# Altium schematic sheet OutputMultiplexer.SchDoc
size A4
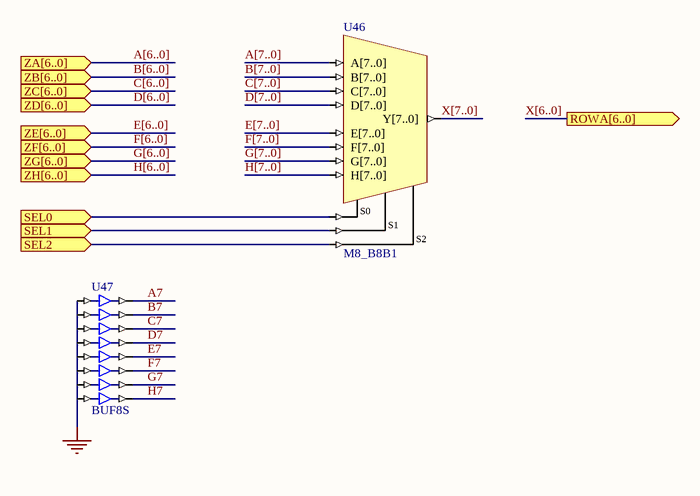
[diagram p0: OutputMultiplexer.SchDoc]

## Parts
U46  M8_B8B1
U47  BUF8S

## Ports
ROWA[6..0] (out), SEL0 (in), SEL1 (in), SEL2 (in), ZA[6..0] (in), ZB[6..0] (in), ZC[6..0] (in), ZD[6..0] (in), ZE[6..0] (in), ZF[6..0] (in), ZG[6..0] (in), ZH[6..0] (in)

## Nets
GND: U47.I0 U47.I1 U47.I2 U47.I3 U47.I4 U47.I5 U47.I6 U47.I7
A7: U47.O0
A[7..0]: U46.A[7..0]
B7: U47.O1
B[7..0]: U46.B[7..0]
C7: U47.O2
C[7..0]: U46.C[7..0]
D7: U47.O3
D[7..0]: U46.D[7..0]
E7: U47.O4
E[7..0]: U46.E[7..0]
F7: U47.O5
F[7..0]: U46.F[7..0]
G7: U47.O6
G[7..0]: U46.G[7..0]
H7: U47.O7
H[7..0]: U46.H[7..0]
SEL0: U46.S0 ; port SEL0
SEL1: U46.S1 ; port SEL1
SEL2: U46.S2 ; port SEL2
X[7..0]: U46.Y[7..0]

## Buses and harness runs
bus A[6..0] = port ZA[6..0]
bus A[7..0]
bus B[6..0] = port ZB[6..0]
bus B[7..0]
bus C[6..0] = port ZC[6..0]
bus C[7..0]
bus D[6..0] = port ZD[6..0]
bus D[7..0]
bus E[6..0] = port ZE[6..0]
bus E[7..0]
bus F[6..0] = port ZF[6..0]
bus F[7..0]
bus G[6..0] = port ZG[6..0]
bus G[7..0]
bus H[6..0] = port ZH[6..0]
bus H[7..0]
bus X[6..0] = port ROWA[6..0]
bus X[7..0]

## Library data of the parts
U46 = M8_B8B1: 8x8-Bit Bus to 1x8-Bit Bus Multiplexer; ArchiveName: GENERIC; Published: 18-Nov-2003; Publisher: Altium Limited; Core Revision: 1.00.00
U47 = BUF8S: 8-Bit General Purpose (Non-inverting) Buffer, Single Pin Version; ArchiveName: GENERIC; Published: 18-Nov-2003; Publisher: Altium Limited; Core Revision: 1.00.00